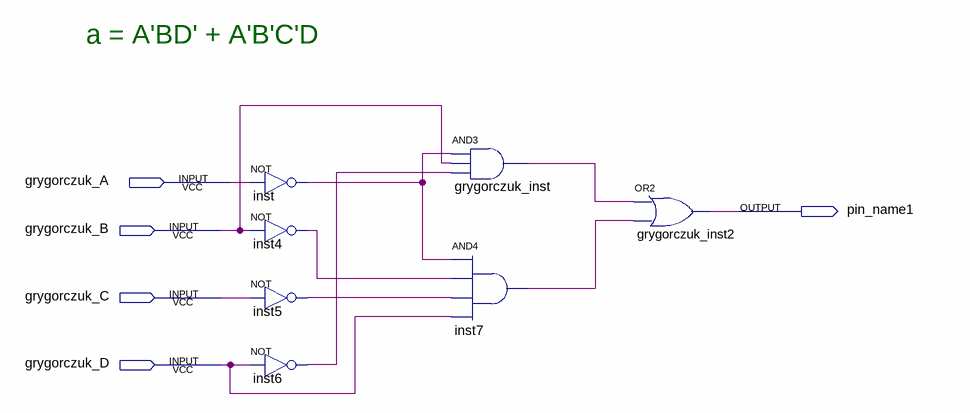
[diagram p0: schematic sheet]
// Quartus schematic SEVEN_SEGMENT_DISPLAY_NORMAL_A.bdf as structural Verilog: 7 symbols, 5 pins
module SEVEN_SEGMENT_DISPLAY_NORMAL_A (
  input  grygorczuk_A,
  input  grygorczuk_B,
  input  grygorczuk_C,
  input  grygorczuk_D,
  output pin_name1
);

  wire grygorczuk_inst_out, inst4_out, inst5_out, inst6_out, inst7_out, inst_out;

  not inst (inst_out, grygorczuk_A);
  not inst4 (inst4_out, grygorczuk_B);
  not inst5 (inst5_out, grygorczuk_C);
  not inst6 (inst6_out, grygorczuk_D);
  and grygorczuk_inst (grygorczuk_inst_out, inst_out, grygorczuk_B, inst6_out);
  and inst7 (inst7_out, inst_out, inst4_out, inst5_out, grygorczuk_D);
  or grygorczuk_inst2 (pin_name1, grygorczuk_inst_out, inst7_out);

  // Notes on the sheet:
  //   a = A'BD' + A'B'C'D
endmodule
